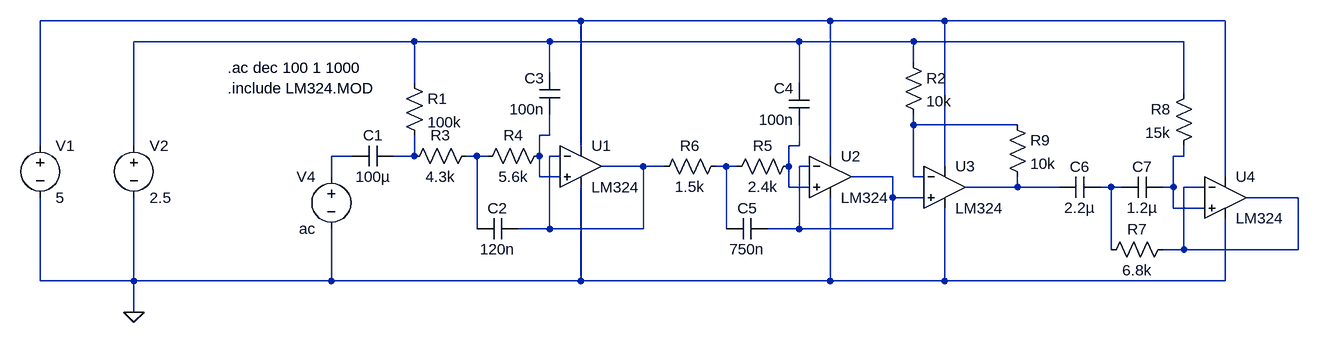
[diagram p0: schematic Input_Stage.asc]
Input_Stage.asc, the LTspice schematic file:
Version 4
SHEET 1 2112 868
WIRE 416 -240 -416 -240
WIRE 800 -240 416 -240
WIRE 976 -240 800 -240
WIRE 1408 -240 976 -240
WIRE 160 -208 -272 -208
WIRE 368 -208 160 -208
WIRE 752 -208 368 -208
WIRE 928 -208 752 -208
WIRE 1344 -208 928 -208
WIRE 928 -176 928 -208
WIRE 368 -160 368 -208
WIRE 160 -144 160 -208
WIRE 752 -144 752 -208
WIRE 1344 -128 1344 -208
WIRE 928 -80 928 -96
WIRE 1088 -80 928 -80
WIRE 368 -64 368 -96
WIRE 368 -64 352 -64
WIRE -416 -48 -416 -240
WIRE -272 -48 -272 -208
WIRE 416 -48 416 -240
WIRE 752 -48 752 -80
WIRE 752 -48 736 -48
WIRE 64 -32 32 -32
WIRE 160 -32 160 -64
WIRE 160 -32 128 -32
WIRE 256 -32 240 -32
WIRE 272 -32 256 -32
WIRE 352 -32 352 -64
WIRE 384 -32 368 -32
WIRE 800 -32 800 -240
WIRE 1344 -32 1344 -48
WIRE 1344 -32 1328 -32
WIRE 512 -16 448 -16
WIRE 544 -16 512 -16
WIRE 640 -16 624 -16
WIRE 656 -16 640 -16
WIRE 736 -16 736 -48
WIRE 768 -16 752 -16
WIRE 976 -16 976 -240
WIRE 32 0 32 -32
WIRE 352 0 352 -32
WIRE 384 0 352 0
WIRE 896 0 832 0
WIRE 928 0 928 -80
WIRE 944 0 928 0
WIRE 1408 0 1408 -240
WIRE 736 16 736 -16
WIRE 768 16 736 16
WIRE 1088 16 1088 0
WIRE 1088 16 1008 16
WIRE 1152 16 1088 16
WIRE 1232 16 1216 16
WIRE 1248 16 1232 16
WIRE 1328 16 1328 -32
WIRE 1328 16 1312 16
WIRE 1376 16 1344 16
WIRE 896 32 896 0
WIRE 944 32 896 32
WIRE 1520 32 1440 32
WIRE 1328 48 1328 16
WIRE 1376 48 1328 48
WIRE 256 80 256 -32
WIRE 368 80 368 -32
WIRE 368 80 320 80
WIRE 512 80 512 -16
WIRE 512 80 368 80
WIRE 640 80 640 -16
WIRE 752 80 752 -16
WIRE 752 80 704 80
WIRE 896 80 896 32
WIRE 896 80 752 80
WIRE 1232 112 1232 16
WIRE 1344 112 1344 16
WIRE 1344 112 1312 112
WIRE 1520 112 1520 32
WIRE 1520 112 1344 112
WIRE -416 160 -416 32
WIRE -272 160 -272 32
WIRE -272 160 -416 160
WIRE 32 160 32 80
WIRE 32 160 -272 160
WIRE 416 160 416 16
WIRE 416 160 32 160
WIRE 800 160 800 32
WIRE 800 160 416 160
WIRE 976 160 976 48
WIRE 976 160 800 160
WIRE 1408 160 1408 64
WIRE 1408 160 976 160
WIRE -272 208 -272 160
FLAG -272 208 0
SYMBOL voltage 32 -16 M0
WINDOW 123 0 0 Left 0
WINDOW 39 0 0 Left 0
SYMATTR InstName V4
SYMATTR Value ac
SYMBOL cap 128 -48 R90
WINDOW 0 0 32 VBottom 2
WINDOW 3 32 32 VTop 2
SYMATTR InstName C1
SYMATTR Value 100µ
SYMBOL cap 320 64 R90
WINDOW 0 0 32 VBottom 2
WINDOW 3 32 32 VTop 2
SYMATTR InstName C2
SYMATTR Value 120n
SYMBOL cap 384 -160 M0
SYMATTR InstName C3
SYMATTR Value 100n
SYMBOL cap 768 -144 M0
SYMATTR InstName C4
SYMATTR Value 100n
SYMBOL cap 704 64 R90
WINDOW 0 0 32 VBottom 2
WINDOW 3 32 32 VTop 2
SYMATTR InstName C5
SYMATTR Value 750n
SYMBOL cap 1312 0 R90
WINDOW 0 0 32 VBottom 2
WINDOW 3 32 32 VTop 2
SYMATTR InstName C7
SYMATTR Value 1.2µ
SYMBOL res 144 -160 R0
SYMATTR InstName R1
SYMATTR Value 100k
SYMBOL res 256 -48 R90
WINDOW 0 0 56 VBottom 2
WINDOW 3 32 56 VTop 2
SYMATTR InstName R3
SYMATTR Value 4.3k
SYMBOL res 368 -48 R90
WINDOW 0 0 56 VBottom 2
WINDOW 3 32 56 VTop 2
SYMATTR InstName R4
SYMATTR Value 5.6k
SYMBOL res 752 -32 R90
WINDOW 0 0 56 VBottom 2
WINDOW 3 32 56 VTop 2
SYMATTR InstName R5
SYMATTR Value 2.4k
SYMBOL res 640 -32 R90
WINDOW 0 0 56 VBottom 2
WINDOW 3 32 56 VTop 2
SYMATTR InstName R6
SYMATTR Value 1.5k
SYMBOL res 1328 96 R90
WINDOW 0 0 56 VBottom 2
WINDOW 3 32 56 VTop 2
SYMATTR InstName R7
SYMATTR Value 6.8k
SYMBOL res 1360 -144 M0
SYMATTR InstName R8
SYMATTR Value 15k
SYMBOL res 1072 -96 R0
SYMATTR InstName R9
SYMATTR Value 10k
SYMBOL OpAmps\\opamp2 416 -80 R0
SYMATTR InstName U1
SYMATTR Value LM324
SYMBOL OpAmps\\opamp2 800 -64 R0
SYMATTR InstName U2
SYMATTR Value LM324
SYMBOL OpAmps\\opamp2 976 -48 R0
SYMATTR InstName U3
SYMATTR Value LM324
SYMBOL voltage -416 -64 R0
WINDOW 123 0 0 Left 0
WINDOW 39 0 0 Left 0
SYMATTR InstName V1
SYMATTR Value 5
SYMBOL OpAmps\\opamp2 1408 -32 R0
SYMATTR InstName U4
SYMATTR Value LM324
SYMBOL voltage -272 -64 R0
WINDOW 123 0 0 Left 0
WINDOW 39 0 0 Left 0
SYMATTR InstName V2
SYMATTR Value 2.5
SYMBOL res 912 -192 R0
SYMATTR InstName R2
SYMATTR Value 10k
SYMBOL cap 1216 0 R90
WINDOW 0 0 32 VBottom 2
WINDOW 3 32 32 VTop 2
SYMATTR InstName C6
SYMATTR Value 2.2µ
TEXT -128 -168 Left 2 !.ac dec 100 1 1000
TEXT -128 -136 Left 2 !.include LM324.MOD

The netlist it stands for:
* Input_Stage.asc
V4 N006 0 ac
C1 N007 N006 100µ
C2 N009 N008 120n
C3 N002 N004 100n
C4 N002 N005 100n
C5 N012 N011 750n
C7 N010 N014 1.2µ
R1 N002 N007 100k
R3 N008 N007 4.3k
R4 N004 N008 5.6k
R5 N005 N011 2.4k
R6 N011 N009 1.5k
R7 N015 N014 6.8k
R8 N002 N010 15k
R9 N003 N013 10k
XU1 N004 N009 N001 0 N009 LM324  ; pins In+ In- V+ V- OUT
XU2 N005 N012 N001 0 N012 LM324  ; pins In+ In- V+ V- OUT
XU3 N012 N003 N001 0 N013 LM324  ; pins In+ In- V+ V- OUT
V1 N001 0 5
XU4 N010 N015 N001 0 N015 LM324  ; pins In+ In- V+ V- OUT
V2 N002 0 2.5
R2 N002 N003 10k
C6 N014 N013 2.2µ
.ac dec 100 1 1000
.include LM324.MOD
.backanno
.end